# Altium schematic sheet USB-C Power.SchDoc
size 292 x 193 mm; SPICEModelCacheBOOBVADC: <root> / <DocumentId>BOOBVADC</DocumentId> / </root>; SheetNumber: 11; SheetTotal: 11; SheetSize: A4
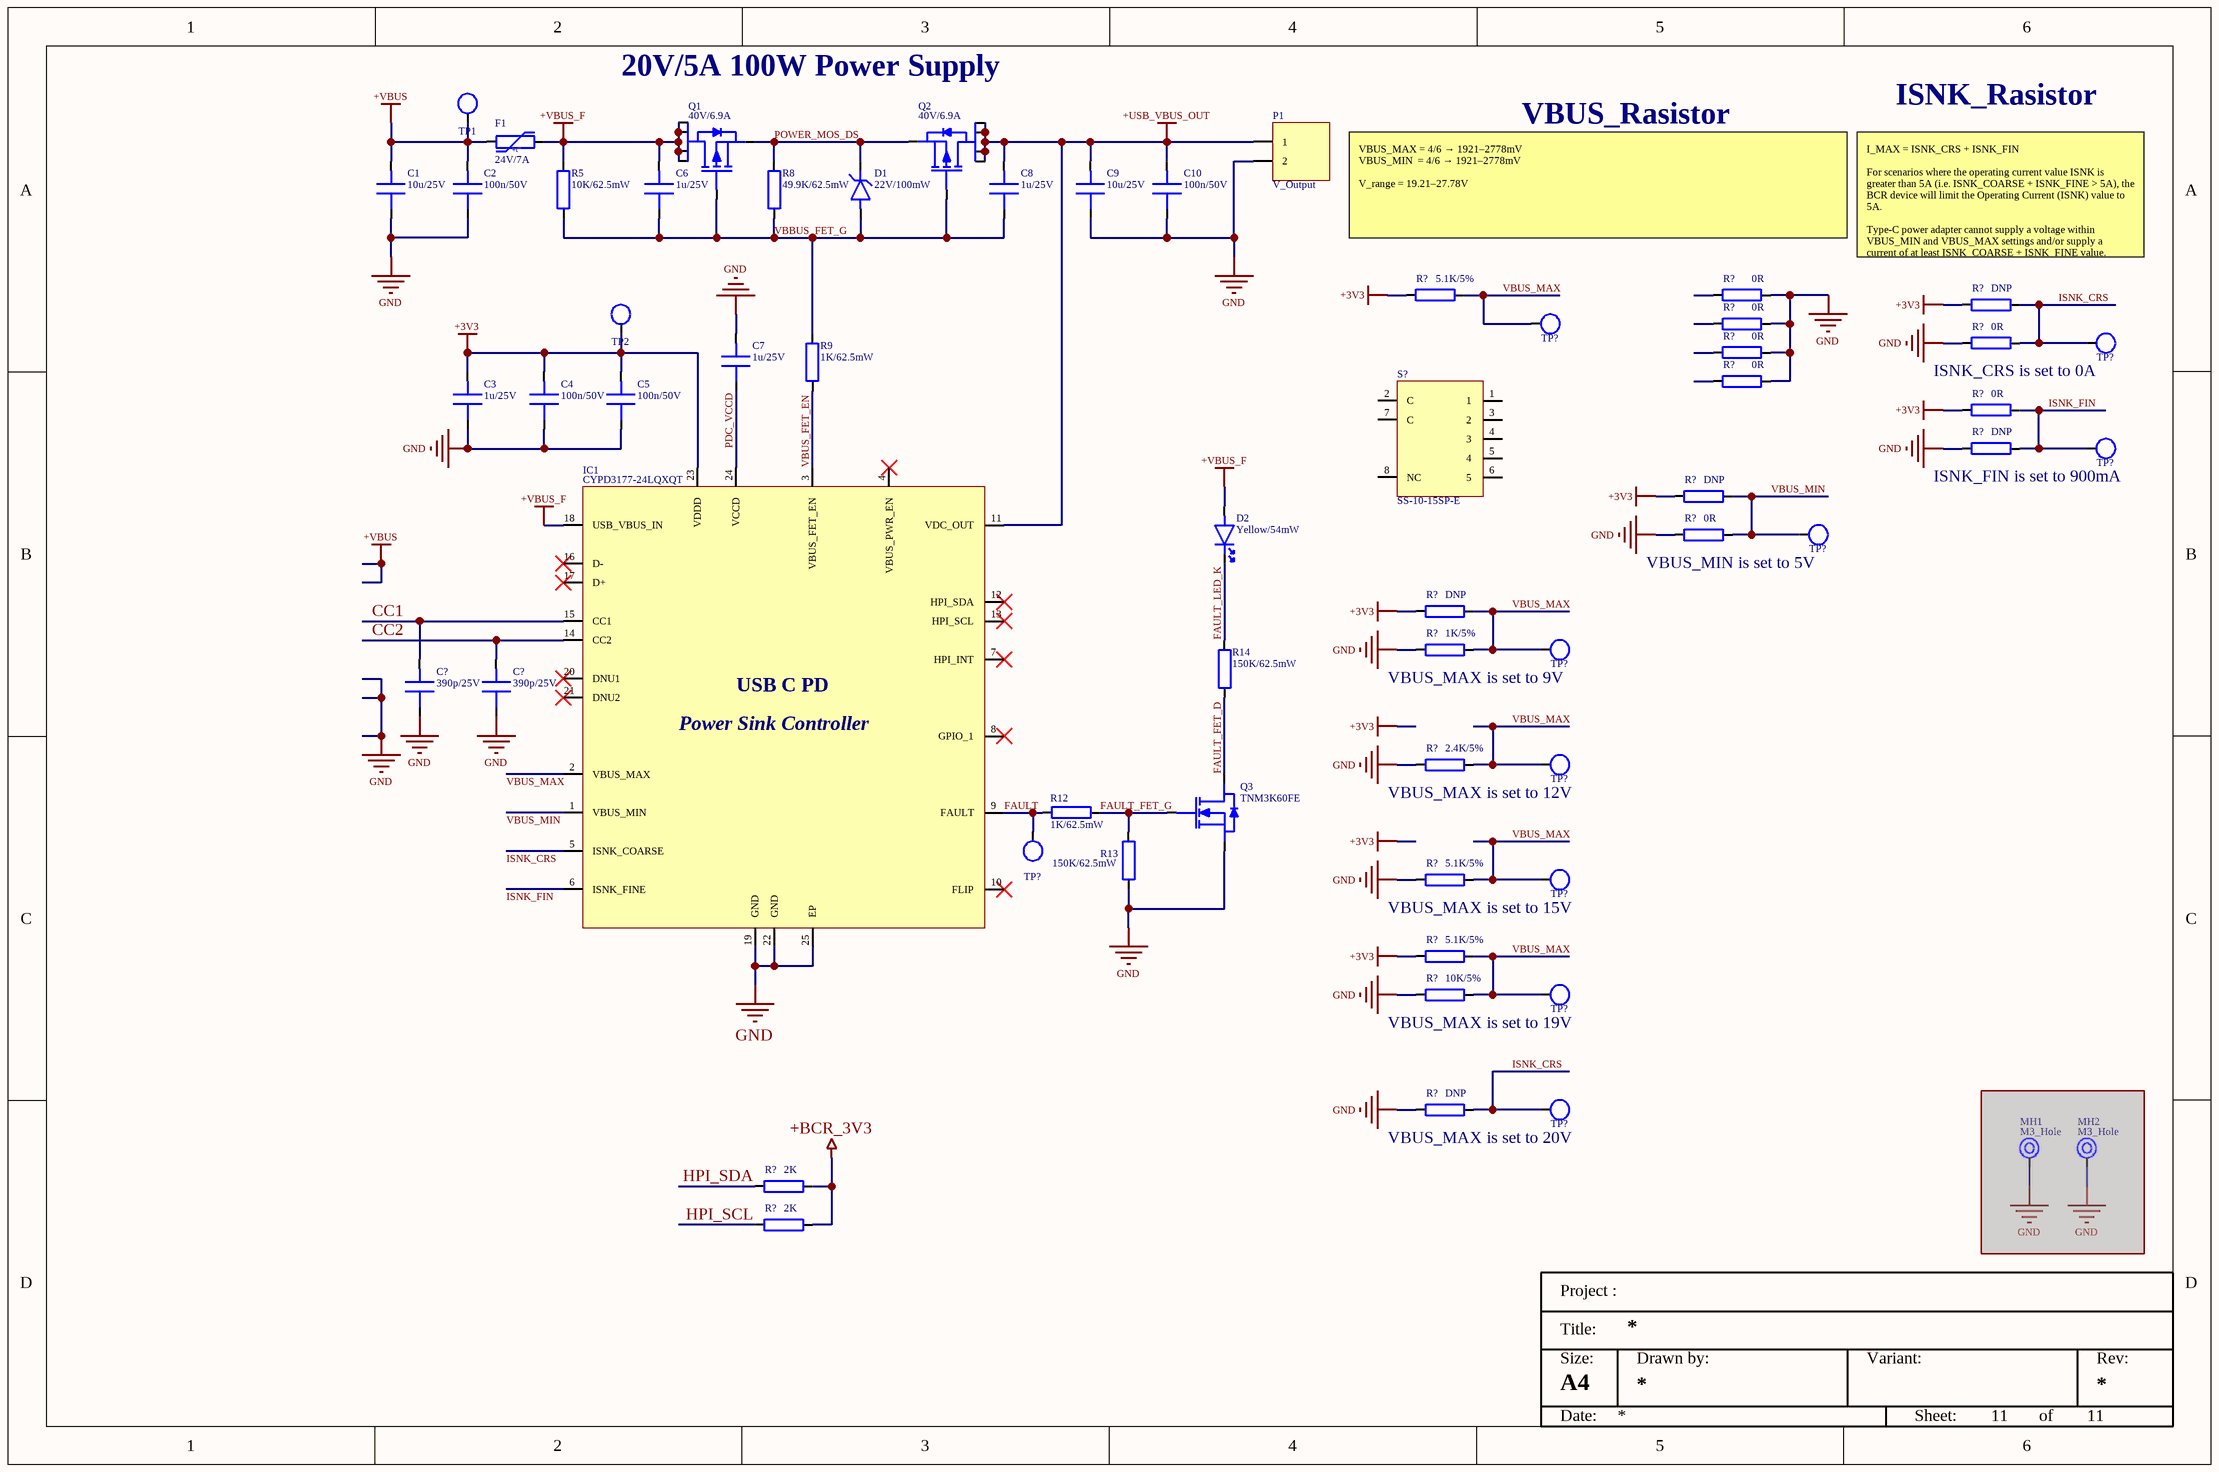
[diagram p0: USB-C Power.SchDoc]

## Parts
(Parts that share a designator on the sheet are numbered #1, #2 ... from top to bottom, then left to right.)
C1  10u/25V  [0805_Cap]
C2  100n/50V  [0402_CAP]
C3  1u/25V  [0805_Cap]
C4  100n/50V  [0402_CAP]
C5  100n/50V  [0402_CAP]
C6  1u/25V  [0805_Cap]
C7  1u/25V  [0805_Cap]
C8  1u/25V  [0805_Cap]
C9  10u/25V  [0805_Cap]
C10  100n/50V  [0402_CAP]
C?#1  390p/25V  [0805_Cap]
C?#2  390p/25V  [0805_Cap]
D1  22V/100mW  [SOD-923-2]
D2  Yellow/54mW  [0603_LED]
F1  24V/7A  [2920_PTC]
IC1  CYPD3177-24LQXQT  [QFN-24]
MH1  M3_Hole  [M3_Hole]  (masked out: inside a compile mask, not in the netlist)
MH2  M3_Hole  [M3_Hole]  (masked out: inside a compile mask, not in the netlist)
P1  V_Output  [XT60PW-M]
Q1  40V/6.9A  [TSOP-6]
Q2  40V/6.9A  [TSOP-6]
Q3  TNM3K60FE  [CST3-3]
R5  10K/62.5mW  [0402_Res]
R8  49.9K/62.5mW  [0402_Res]
R9  1K/62.5mW  [0402_Res]
R12  1K/62.5mW  [0402_Res]
R13  150K/62.5mW  [0402_Res]
R14  150K/62.5mW  [0402_Res]
R?#1  5.1K/5%  [0402_Res]
R?#2  0R  [0402_Res]
R?#3  DNP  [0402_Res]
R?#4  0R  [0402_Res]
R?#5  0R  [0402_Res]
R?#6  0R  [0402_Res]
R?#7  0R  [0402_Res]
R?#8  0R  [0402_Res]
R?#9  DNP  [0402_Res]
R?#10  DNP  [0402_Res]
R?#11  0R  [0402_Res]
R?#12  DNP  [0402_Res]
R?#13  1K/5%  [0402_Res]
R?#14  2.4K/5%  [0402_Res]
R?#15  5.1K/5%  [0402_Res]
R?#16  5.1K/5%  [0402_Res]
R?#17  10K/5%  [0402_Res]
R?#18  DNP  [0402_Res]
R?#19  2K  [0402_Res]
R?#20  2K  [0402_Res]
S?  SS-10-15SP-E
TP1  Red/Small  [TestPoint_dip_big]  (value not drawn)
TP2  white/Small  [TestPoint_dip_big]  (value not drawn)
TP?#1  SMD_Point  [TestPoint_dip_big]  (value not drawn)
TP?#2  SMD_Point  [TestPoint_dip_big]  (value not drawn)
TP?#3  SMD_Point  [TestPoint_dip_big]  (value not drawn)
TP?#4  SMD_Point  [TestPoint_dip_big]  (value not drawn)
TP?#5  SMD_Point  [TestPoint_dip_big]  (value not drawn)
TP?#6  SMD_Point  [TestPoint_dip_big]  (value not drawn)
TP?#7  white/Small  [TestPoint_dip_big]  (value not drawn)
TP?#8  SMD_Point  [TestPoint_dip_big]  (value not drawn)
TP?#9  SMD_Point  [TestPoint_dip_big]  (value not drawn)
TP?#10  SMD_Point  [TestPoint_dip_big]  (value not drawn)

## Nets
+3V3: C3.1 C4.1 C5.1 IC1.23(VDDD) R?#1.1 R?#3.1 R?#8.1 R?#10.1 R?#12.2 R?#16.1 TP2.1
+BCR_3V3: R?#19.1 R?#20.1
+USB_VBUS_OUT: C8.1 C9.1 C10.1 IC1.11(VDC_OUT) P1.1 Q2.1(D1_1) Q2.2(D1_2) Q2.5(D1_3) Q2.6(D1_4)
+VBUS: C1.1 C2.1 F1.1 TP1.1
+VBUS_F: C6.1 D2.1(A) F1.2 IC1.18(USB_VBUS_IN) Q1.1(D1_1) Q1.2(D1_2) Q1.5(D1_3) Q1.6(D1_4) R5.1
GND: C1.2 C2.2 C3.2 C4.2 C5.2 C7.1 C9.2 C10.2 C?#1.2 C?#2.2 IC1.19(GND) IC1.22(GND) IC1.25(EP) P1.2 Q3.3(S) R13.2 R?#2.2 R?#4.2 R?#5.2 R?#6.2 R?#7.2 R?#9.2 R?#11.2 R?#13.2 R?#14.2 R?#15.1 R?#17.2 R?#18.2
CC1: C?#1.1 IC1.15(CC1)
CC2: C?#2.1 IC1.14(CC2)
FAULT: IC1.9(FAULT) R12.1 TP?#7.1
FAULT_FET_D: Q3.1(D) R14.1
FAULT_FET_G: Q3.2(G) R12.2 R13.1
FAULT_LED_K: D2.2(K) R14.2
HPI_SCL: R?#20.2
HPI_SDA: R?#19.2
ISNK_CRS: IC1.5(ISNK_COARSE) R?#3.2 R?#5.1 R?#18.1 TP?#2.1 TP?#10.1
ISNK_FIN: IC1.6(ISNK_FINE) R?#8.2 R?#9.1 TP?#3.1
PDC_VCCD: C7.2 IC1.24(VCCD)
POWER_MOS_DS: D1.2(K) Q1.4(S1) Q2.4(S1) R8.2
VBBUS_FET_G: C6.2 C8.2 D1.1(A) Q1.3(G1) Q2.3(G1) R5.2 R8.1 R9.2
VBUS_FET_EN: IC1.3(VBUS_FET_EN) R9.1
VBUS_MAX: IC1.2(VBUS_MAX) R?#1.2 R?#12.1 R?#13.1 R?#14.1 R?#15.2 R?#16.2 R?#17.1 TP?#1.1 TP?#5.1 TP?#6.1 TP?#8.1 TP?#9.1
VBUS_MIN: IC1.1(VBUS_MIN) R?#10.2 R?#11.1 TP?#4.1

Not connected (* = marked no-connect by the designer): IC1 4(VBUS_PWR_EN)* 7(HPI_INT)* 8(GPIO_1)* 10(FLIP)* 12(HPI_SDA)* 13(HPI_SCL)* 16(D-)* 17(D+)* 20(DNU1)* 21(DNU2)*; R?#2 1; R?#4 1; R?#6 1; R?#7 1; S? 1 2(C) 3(2) 4(3) 5(4) 6(5) 7(C) 8(NC)

## Notes on the sheet
- 20V/5A 100W Power Supply
- VBUS_Rasistor
- ISNK_Rasistor
- (near R?#2) VBUS_MAX = 4/6 → 1921–2778mV
  VBUS_MIN  = 4/6 → 1921–2778mV
  V_range = 19.21–27.78V
- (near R?#3) I_MAX = ISNK_CRS + ISNK_FIN
  For scenarios where the operating current value ISNK is greater than 5A (i.e. ISNK_COARSE + ISNK_FINE > 5A), the BCR device will limit the Operating Current (ISNK) value to 5A.
  Type-C power adapter cannot supply a voltage within VBUS_MIN and VBUS_MAX settings and/or supply a current of at least ISNK_COARSE + ISNK_FINE value.
- ISNK_CRS is set to 0A
- ISNK_FIN is set to 900mA
- VBUS_MIN is set to 5V
- VBUS_MAX is set to 9V
- VBUS_MAX is set to 12V
- VBUS_MAX is set to 15V
- VBUS_MAX is set to 19V
- VBUS_MAX is set to 20V
- Project :
- Size:
- Title:
- Drawn by:
- Variant:
- Rev:
- Date:
- Sheet:
- of
- (in symbol CYPD3177-24LQXQ) USB C PD; Power Sink Controller
- (in symbol PTC) +t°

## Library data of the parts
C1 C9 = Cap: 25V 10uF X5R - Multilayer Ceramic Capacitors MLCC - SMD/SMT ROHS; Mfr. #: GRM21BR61E106KA73K; Mfr.: Murata Electronics; Datasheet: https://jlcpcb.com/parts/2nd/Capacitors/Multilayer_Ceramic_Capacitors_MLCC_SMD_SMT_33; Distributor_Link: https://jlcpcb.com/partdetail/4477883-GRM21BR61E106KA73K/C3909351; Distributor #: C3909351
C2 C4 C5 C10 = Cap: 16V 100nF -20%~+80% 0402  Multilayer Ceramic Capacitors MLCC - SMD/SMT ROHS; Mfr. #: 0402F104Z160NT; Mfr.: FH (Guangdong Fenghua Advanced Tech); Datasheet: https://datasheet.lcsc.com/lcsc/2202131930_FH--Guangdong-Fenghua-Advanced-Tech-0402F104Z160NT_C2838746.pdf; Distributor_Link: https://jlcpcb.com/partdetail/3013916-0402F104Z160NT/C2838746; Distributor #: C2838746
C3 C6-C8 C?#1 C?#2 = Cap: 25V 1uF Y5V ±20% 0805  Multilayer Ceramic Capacitors MLCC - SMD/SMT ROHS; Mfr. #: 0805F105M250NT; Mfr.: FH (Guangdong Fenghua Advanced Tech); Datasheet: https://datasheet.lcsc.com/lcsc/1810311214_FH--Guangdong-Fenghua-Advanced-Tech-0805F105M250NT_C89378.pdf; Distributor_Link: https://jlcpcb.com/partdetail/90558-0805F105M250NT/C89378; Distributor #: C89378
D1 = Diode_Zener: Zener Diodes CDZV22B is the 100mW type compact (1006 size) diode for voltage regulation.; Mfr. #: CDZVT2R22B; Mfr.: ROHM Semiconductor; Distributor_Link: https://www.mouser.tw/ProductDetail/ROHM-Semiconductor/CDZVT2R22B?qs=4v%252BiZTmLVHG6BDwFzUsoYg%3D%3D; Datasheet: https://www.rohm.com/datasheet?p=CDZV22B&dist=Mouser&media=referral&source=mouser.com&campaign=Mouser; Distributor #: 755-CDZVT2R22B
D2 = LED: 590nm~590nm yellow 54mW 0603  Light Emitting Diodes (LED) ROHS; Mfr. #: SML-D12Y8WT86R; Mfr.: ROHM Semicon; Distributor_Link: https://jlcpcb.com/partdetail/RohmSemicon-SMLD12Y8WT86R/C600870; Datasheet: https://datasheet.lcsc.com/lcsc/2006151335_ROHM-Semicon-SML-D12Y8WT86R_C600870.pdf; Distributor #: C600870
F1 = PTC: Resettable Fuses - PPTC PTC SMD RESETTABLE FUSE; Mfr. #: 2920L700/24SLER; Mfr.: Littelfuse; Distributor_Link: https://www.mouser.tw/ProductDetail/Littelfuse/2920L700-24SLER?qs=7MVldsJ5UazQEVth1QGslQ%3D%3D; Datasheet: https://www.mouser.tw/datasheet/2/240/littelfuse_ptc_low_rho_datasheet_pdf-2956203.pdf; Distributor #: 576-2920L700/24SLER
IC1 = CYPD3177-24LQXQ: USB Interface IC USB Type-C port controller CYPD3177; Mfr.: Infineon Technologies; Distributor_Link: https://www.mouser.tw/ProductDetail/727-CYPD3177-24LQXQT; Mfr. #: CYPD3177-24LQXQT; Datasheet: https://www.mouser.tw/datasheet/2/196/Infineon_EZ_PD_BCR_Datasheet_USB_Type_C_Port_Contr-3161917.pdf; Distributor #: 727-CYPD3177-24LQXQT
MH1 MH2 = Hole: M3 Hole
P1 = Header_2x1: General header 2x1; Mfr. #: *; Mfr.: *; Distributor_Link: *; Datasheet: *; Distributor #: *
Q1 Q2 = MOSFET_P_1: MOSFET P Ch -40Vds 20Vgs AEC-Q101 Qualified; Mfr. #: SQ3419EV-T1_GE3; Mfr.: Vishay Semiconductors; Distributor_Link: https://www.mouser.tw/ProductDetail/Vishay-Semiconductors/SQ3419EV-T1_GE3?qs=Vcr9%2FL0R50hjQdrP75bU0Q%3D%3D&gclid=CjwKCAjwg-GjBhBnEiwAMUvNW2_QHlpdOmMyQk5t1a0eb3FLtCoKgaDvyU_lKGTsS4lC8mEsJurJAhoCUjcQAvD_BwE; Datasheet: https://www.vishay.com/doc?68210; Distributor #: 78-SQ3419EV-T1_GE3
Q3 = MOSFET_N: 60V 0.3A 2Ω@10V SOT-523  MOSFETs ROHS; Mfr. #: SSM3K72KCT,L3F; Mfr.: Toshiba; Distributor_Link: https://www.mouser.tw/ProductDetail/757-SSM3K72KCTL3F; Datasheet: https://www.mouser.tw/datasheet/2/408/SSM3K72KCT_datasheet_en_20201124-1099204.pdf; Distributor #: 757-SSM3K72KCTL3F
R5 = Res: 62.5mW Thick Film Resistors ±100ppm/℃ ±5% 10kΩ 0402  Chip Resistor - Surface Mount ROHS; Mfr. #: CR-02JA6---10K; Mfr.: Viking Tech; Distributor_Link: https://jlcpcb.com/partdetail/VikingTech-CR_02JA6_10K/C2924170; Datasheet: https://datasheet.lcsc.com/lcsc/2111241930_Viking-Tech-CR-02JA6---10K_C2924170.pdf; Distributor #: C2924170
R8 = Res: 62.5mW Thick Film Resistors ±1% 49.9kΩ 0402  Chip Resistor - Surface Mount ROHS; Mfr. #: CR0402FF4992G; Mfr.: LIZ Elec; Distributor_Link: https://jlcpcb.com/partdetail/LizElec-CR0402FF4992G/C100457; Datasheet: https://datasheet.lcsc.com/lcsc/1810170232_LIZ-Elec-CR0402FF4992G_C100457.pdf; Distributor #: C100457
R9 R12 = Res: 63mW ±5% 1kΩ 0402  Chip Resistor - Surface Mount ROHS; Mfr. #: CR0402J1K00Q10Z; Mfr.: Ever Ohms Tech; Distributor_Link: https://jlcpcb.com/partdetail/Ever_OhmsTech-CR0402J1K00Q10Z/C881213; Datasheet: https://datasheet.lcsc.com/lcsc/2010191904_Ever-Ohms-Tech-CR0402J1K00Q10Z_C881213.pdf; Distributor #: C881213
R13 R14 = Res: 62.5mW Thick Film Resistors ±100ppm/℃ ±5% 150kΩ 0402 Chip Resistor - Surface Mount ROHS; Mfr. #: ARG03FTC1503; Mfr.: Viking Tech; Distributor_Link: https://jlcpcb.com/partdetail/VikingTech-ARG03FTC1503/C409708; Datasheet: https://datasheet.lcsc.com/lcsc/1912111437_Viking-Tech-CR-02JL6--150K_C409708.pdf; Distributor #: C409708
R?#1 R?#3 R?#8 R?#10 R?#15 R?#16 = Res: 62.5mW ±300ppm/℃ ±5% 0Ω 0402 Chip Resistor - Surface Mount ROHS; Mfr. #: SC0402J0000I2ANRH; Mfr.: Sunway; Distributor_Link: https://jlcpcb.com/partdetail/Sunway-SC0402J0000I2ANRH/C3152098; Datasheet: https://datasheet.lcsc.com/lcsc/2207281800_Sunway-SC0402J0000I2ANRH_C3152098.pdf; Distributor #: C3152098
R?#2 R?#4-R?#7 R?#11 R?#13 R?#14 R?#17 R?#19 R?#20 = Res: DNP; Mfr. #: N/A; Mfr.: N/A; Distributor_Link: N/A; Datasheet: N/A; Distributor #: N/A
R?#9 R?#12 R?#18 = Res: Mfr. #: N/A; Mfr.: N/A; Distributor_Link: N/A; Datasheet: N/A; Distributor #: N/A
S? = SS-10-15SP-E: Single-pole, five-throw switch; Mfr. #: SS-10-15SPE; Mfr.: Nidec Components; Distributor_Link: https://www.mouser.tw/ProductDetail/Nidec-Components/SS-10-15SPE?qs=XeJtXLiO41RzCW0%252BeLYfaA%3D%3D; Datasheet: https://www.mouser.tw/datasheet/2/972/ss_10_26s_2050-1827383.pdf; Distributor #: 229-SS-10-15SPE
TP1 TP2 TP?#1-TP?#10 = Test_Point: General test point; Mfr. #: N/A; Mfr.: N/A; Distributor_Link: N/A; Datasheet: N/A; Distributor #: N/A